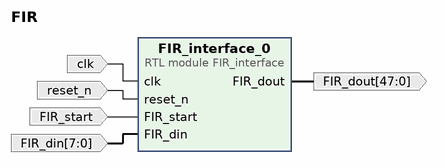
[diagram p0: block diagram of the top level]
# Vivado block design FIR, xc7s50csga324-1, Vivado 2018.3
create_bd_design FIR

create_bd_port -dir I -type clk clk
set_property -dict {CONFIG.FREQ_HZ 108000000} [get_bd_ports clk]
create_bd_port -dir I -type rst reset_n
create_bd_port -dir O -from 47 -to 0 FIR_dout
create_bd_port -dir I FIR_start
create_bd_port -dir I -from 7 -to 0 FIR_din

create_bd_cell -type module -reference FIR_interface FIR_interface_0

# ---- connections ----

connect_bd_net [get_bd_ports clk] [get_bd_pins FIR_interface_0/clk]
connect_bd_net [get_bd_ports reset_n] [get_bd_pins FIR_interface_0/reset_n]
connect_bd_net [get_bd_pins FIR_interface_0/FIR_dout] [get_bd_ports FIR_dout]
connect_bd_net [get_bd_ports FIR_start] [get_bd_pins FIR_interface_0/FIR_start]
connect_bd_net [get_bd_ports FIR_din] [get_bd_pins FIR_interface_0/FIR_din]

validate_bd_design
save_bd_design
